# EAGLE schematic power_supply_smd (EAGLE 7.1.0)
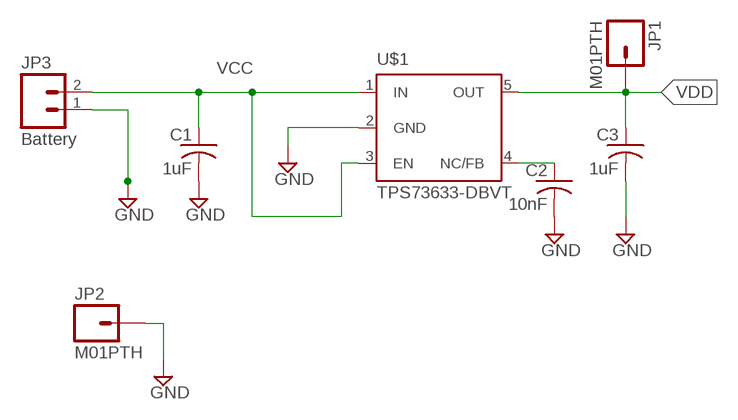
[diagram p0: schematic, sheet 1]

## Parts
C1  1uF  C-USC0805  [C0805]
C2  10nF  C-USC0805  [C0805]
C3  1uF  C-USC0805  [C0805]
JP1  M01PTH  [1X01]
JP2  M01PTH  [1X01]
JP3  Battery  M02PTH  [1X02]
U$1  TPS73633-DBVT  [SOT23-DBV]

## Nets
GND: C1.2 C2.2 C3.2 JP2.1 JP3.1 U$1.2(GND)
N$1: C2.1 U$1.4(NC/FB)
VCC: C1.1 JP3.2 U$1.1(IN) U$1.3(EN)
VDD: C3.1 JP1.1 U$1.5(OUT)

## Library data of the parts
C1-C3 = resistor:C-US: CAPACITOR, American symbol
JP1 JP2 = SparkFun:M01: Header 1 Standard 1-pin 0.1" header. Use with straight break away headers (SKU : PRT-00116), right angle break away headers (PRT-00553), swiss pins (PRT-00743), machine pins (PRT-00117), and female headers (PRT-00115).
JP3 = SparkFun:M02: Header 2 Standard 2-pin 0.1" header. Use with straight break away headers (SKU : PRT-00116), right angle break away headers (PRT-00553), swiss pins (PRT-00743), machine pins (PRT-00117), and female headers (PRT-00115). Molex polarized connector foot print use with SKU : PRT-08233 with associated crimp pins and housings.
U$1 = Power:TPS73633-DBVT